# EAGLE design pocketbone (EAGLE 7.6.0)

## Sheet 1 of 3
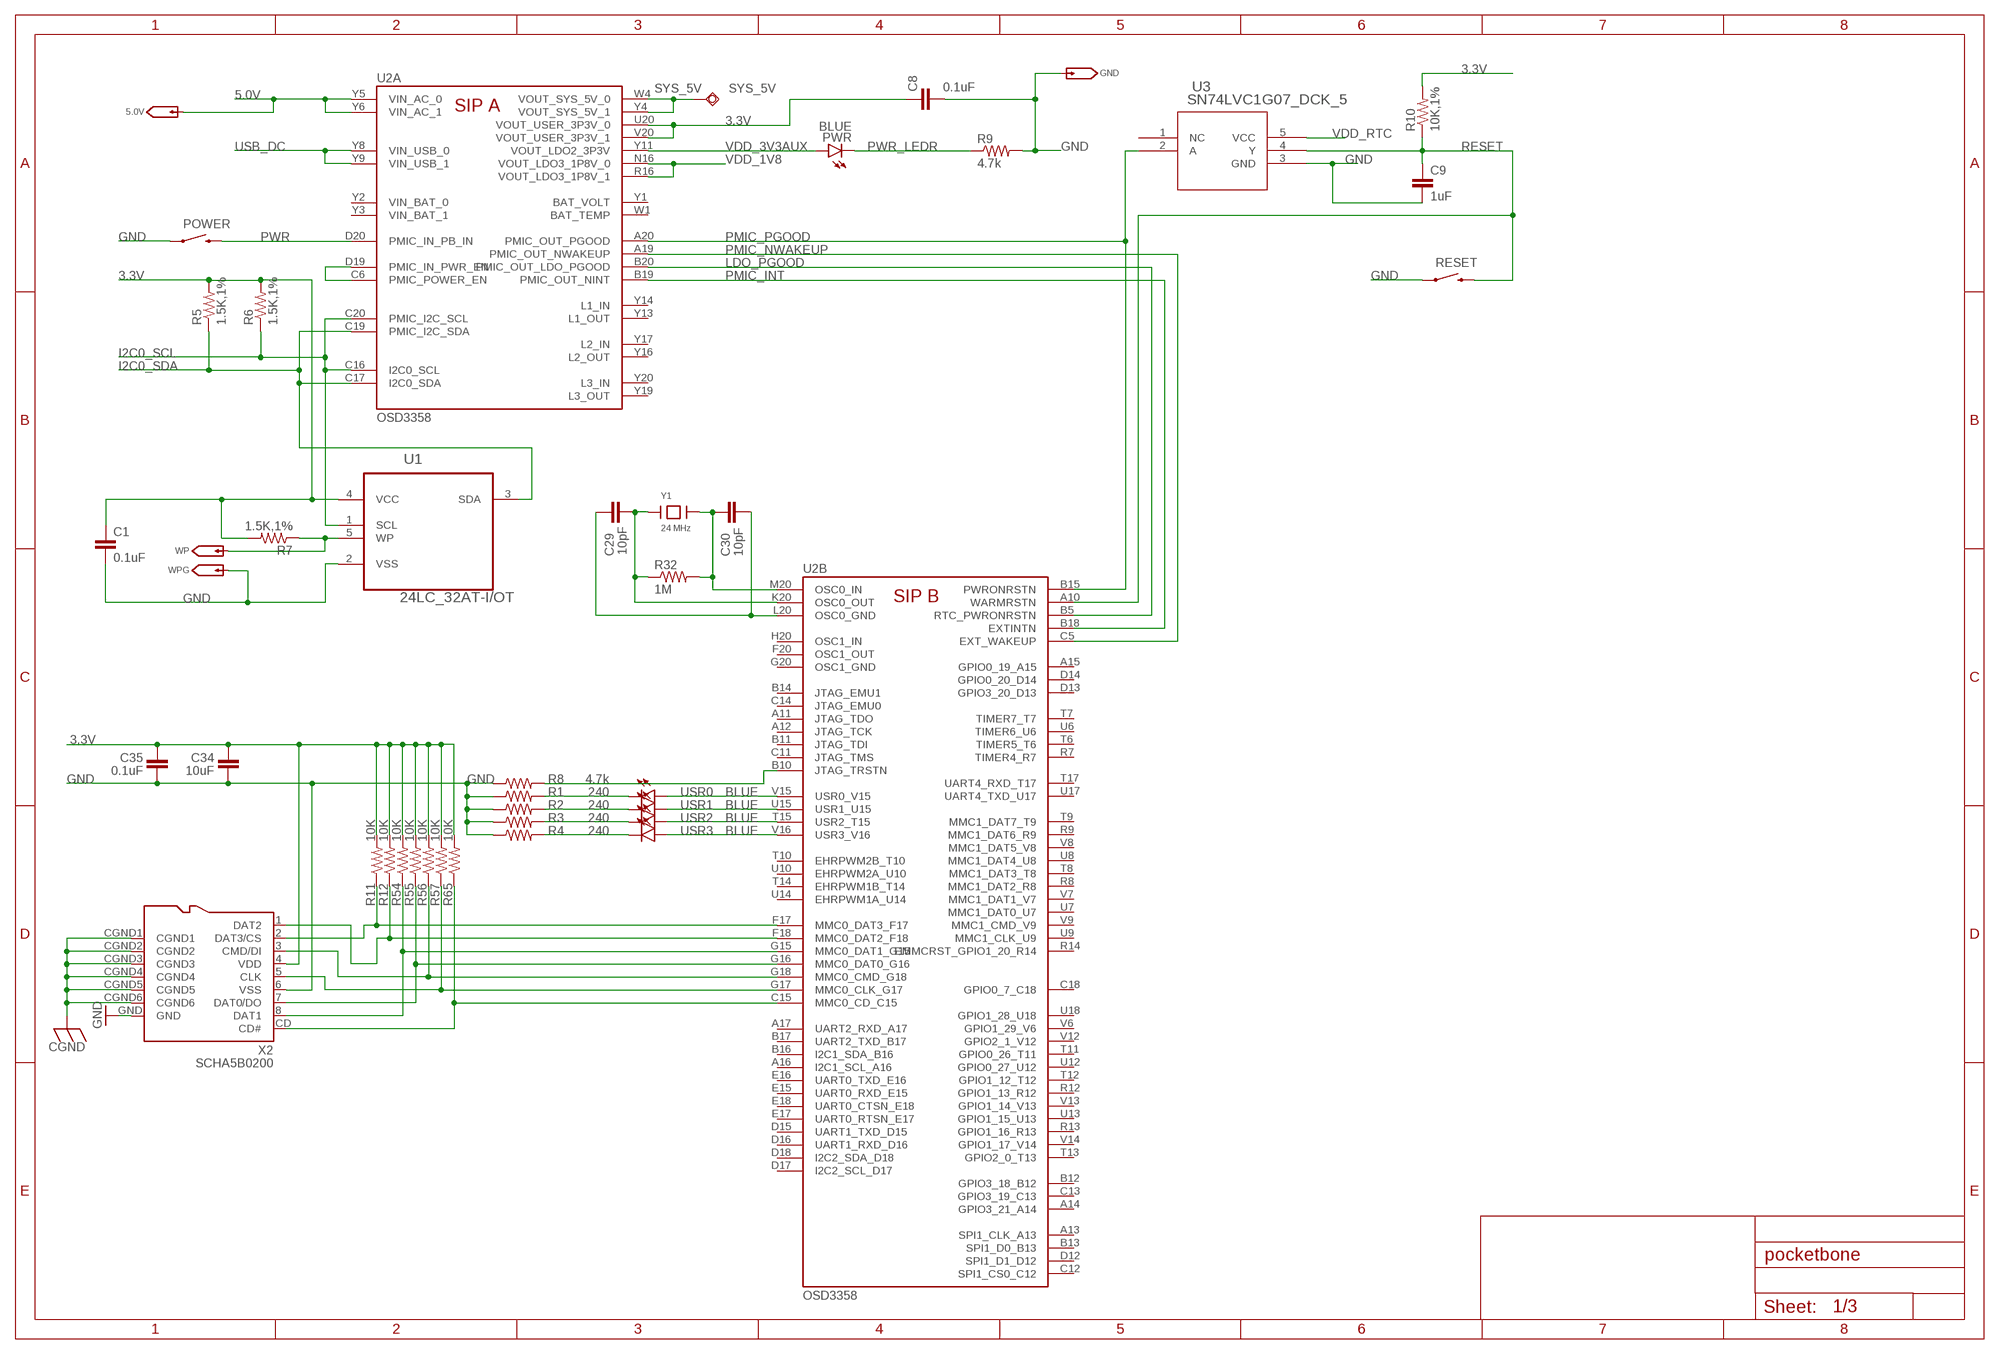
[diagram p0: schematic, sheet 1]

### Parts
5.0V  GHI_TESTPAD/W_HOLE_1X1  [GHI2_TESTPAD/W_HOLE_1X1]
C1  0.1uF  CAP0402-CAP  [0402-CAP]
C8  0.1uF  CAP0402-CAP  [0402-CAP]
C9  1uF  CAP0402-CAP  [0402-CAP]
C29  10pF  CAP0402-CAP  [0402-CAP]
C30  10pF  CAP0402-CAP  [0402-CAP]
C34  10uF  CAP0805  [0805]
C35  0.1uF  CAP0402-CAP  [0402-CAP]
GND  GHI_TESTPAD/W_HOLE_1X1  [GHI2_TESTPAD/W_HOLE_1X1]
POWER  SWITCH-MOMENTARY-2SMD-1101NE  [TACTILE-SWITCH-1101NE]
PWR  BLUE  LED0603  [LED-0603]
R1  240  RESISTOR0402-RES  [0402-RES]
R2  240  RESISTOR0402-RES  [0402-RES]
R3  240  RESISTOR0402-RES  [0402-RES]
R4  240  RESISTOR0402-RES  [0402-RES]
R5  1.5K,1%  RESISTOR0402-RES  [0402-RES]
R6  1.5K,1%  RESISTOR0402-RES  [0402-RES]
R7  1.5K,1%  RESISTOR0402-RES  [0402-RES]
R8  4.7k  RESISTOR0402-RES  [0402-RES]
R9  4.7k  RESISTOR0402-RES  [0402-RES]
R10  10K,1%  RESISTOR0402-RES  [0402-RES]
R11  10K  RESISTOR0402-RES  [0402-RES]
R12  10K  RESISTOR0402-RES  [0402-RES]
R32  1M  RESISTOR0402-RES  [0402-RES]
R54  10K  RESISTOR0402-RES  [0402-RES]
R55  10K  RESISTOR0402-RES  [0402-RES]
R56  10K  RESISTOR0402-RES  [0402-RES]
R57  10K  RESISTOR0402-RES  [0402-RES]
R65  10K  RESISTOR0402-RES  [0402-RES]
RESET  SWITCH-MOMENTARY-2SMD-1101NE  [TACTILE-SWITCH-1101NE]
SYS_5V  TPSQB1,27  [B1,27]
U1  24LC_32AT-I/OT  [SOT95P290X145-5N]
U2  OSD3358  [OSD3358]
U3  SN74LVC1G07_DCK_5  [DCK5]
USR0  BLUE  LED0603  [LED-0603]
USR1  BLUE  LED0603  [LED-0603]
USR2  BLUE  LED0603  [LED-0603]
USR3  BLUE  LED0603  [LED-0603]
WP  GHI_TESTPAD/W_HOLE_1X1  [GHI2_TESTPAD/W_HOLE_1X1]
WPG  GHI_TESTPAD/W_HOLE_1X1  [GHI2_TESTPAD/W_HOLE_1X1]
X2  SCHA5B0200  SCHA5B0200(ALPS_USD)  [SCHA5B0200]
Y1  24 MHz  CRYSTAL_5X3.2MM  [CRYSTAL_5X3.2MM]

### Nets
3.3V [power]: C1.1 C8.1 C34.2 C35.2 R5.2 R6.2 R7.2 R10.2 R11.2 R12.2 R54.2 R55.2 R56.2 R57.2 R65.2 U1.4(VCC) U2.U20(A:VOUT_USER_3P3V_0) U2.V20(A:VOUT_USER_3P3V_1) X2.4(VDD) ; also sheet 2
5.0V [power]: 5.0V.P$1(TP) U2.Y5(A:VIN_AC_0) U2.Y6(A:VIN_AC_1) ; also sheet 2
CGND: X2.CGND1 X2.CGND2 X2.CGND3 X2.CGND4 X2.CGND5 X2.CGND6 ; also sheet 2
GND [ground]: C1.2 C8.2 C9.2 C34.1 C35.1 GND.P$1(TP) POWER.1 R1.1 R2.1 R3.1 R4.1 R8.1 R9.2 RESET.1 U1.2(VSS) U3.3(GND) WPG.P$1(TP) X2.6(VSS) X2.GND ; also sheet 2,3
I2C0_SCL: R6.1 U1.1(SCL) U2.C16(A:I2C0_SCL) U2.C20(A:PMIC_I2C_SCL)
I2C0_SDA: R5.1 U1.3(SDA) U2.C17(A:I2C0_SDA) U2.C19(A:PMIC_I2C_SDA)
LDO_PGOOD: U2.B5(B:RTC_PWRONRSTN) U2.B20(A:PMIC_OUT_LDO_PGOOD)
N$3: R56.1 U2.G18(B:MMC0_CMD_G18) X2.3(CMD/DI)
N$4: R55.1 U2.G16(B:MMC0_DAT0_G16) X2.7(DAT0/DO)
N$6: R54.1 U2.G15(B:MMC0_DAT1_G15) X2.8(DAT1)
N$7: R65.1 U2.C15(B:MMC0_CD_C15) X2.CD(CD#)
N$8: R57.1 U2.G17(B:MMC0_CLK_G17) X2.5(CLK)
N$9: R11.1 U2.F17(B:MMC0_DAT3_F17) X2.2(DAT3/CS)
N$12: U2.C6(A:PMIC_POWER_EN) U2.D19(A:PMIC_IN_PWR_EN)
N$26: C30.1 R32.2 U2.M20(B:OSC0_IN) Y1.2
N$27: C29.1 R32.1 U2.K20(B:OSC0_OUT) Y1.1
N$28: R7.1 U1.5(WP) WP.P$1(TP)
N$31: C29.2 C30.2 U2.L20(B:OSC0_GND)
N$42: R8.2 U2.B10(B:JTAG_TRSTN)
N$43: U2.V16(B:USR3_V16) USR3.A
N$44: U2.T15(B:USR2_T15) USR2.A
N$45: U2.U15(B:USR1_U15) USR1.A
N$46: U2.V15(B:USR0_V15) USR0.A
N$47: R1.2 USR0.C
N$57: R2.2 USR1.C
N$58: R3.2 USR2.C
N$59: R4.2 USR3.C
NTE1: R12.1 U2.F18(B:MMC0_DAT2_F18) X2.1(DAT2)
PMIC_INT: U2.B18(B:EXTINTN) U2.B19(A:PMIC_OUT_NINT)
PMIC_NWAKEUP: U2.A19(A:PMIC_OUT_NWAKEUP) U2.C5(B:EXT_WAKEUP)
PMIC_PGOOD: U2.A20(A:PMIC_OUT_PGOOD) U2.B15(B:PWRONRSTN) U3.2(A)
PWR: POWER.2 U2.D20(A:PMIC_IN_PB_IN)
PWR_LEDR: PWR.C R9.1
RESET: C9.1 R10.1 RESET.2 U2.A10(B:WARMRSTN) U3.4(Y)
SYS_5V [power]: SYS_5V.TP U2.W4(A:VOUT_SYS_5V_0) U2.Y4(A:VOUT_SYS_5V_1) ; also sheet 2
USB_DC [power]: U2.Y8(A:VIN_USB_0) U2.Y9(A:VIN_USB_1) ; also sheet 2
VDD_1V8: U2.N16(A:VOUT_LDO3_1P8V_0) U2.R16(A:VOUT_LDO3_1P8V_1) ; also sheet 3
VDD_3V3AUX: PWR.A U2.Y11(A:VOUT_LDO2_3P3V)
VDD_RTC: U3.5(VCC) ; also sheet 3
Unconnected: U2.A11(B:JTAG_TDO) U2.A12(B:JTAG_TCK) U2.A13(B:SPI1_CLK_A13) U2.A14(B:GPIO3_21_A14) U2.A15(B:GPIO0_19_A15) U2.A16(B:I2C1_SCL_A16) U2.A17(B:UART2_RXD_A17) U2.B1(D:NC4) U2.B2(D:NC5) U2.B3(D:NC6) U2.B11(B:JTAG_TDI) U2.B12(B:GPIO3_18_B12) U2.B13(B:SPI1_D0_B13) U2.B14(B:JTAG_EMU1) U2.B16(B:I2C1_SDA_B16) U2.B17(B:UART2_TXD_B17) U2.C1(D:NC12) U2.C2(D:NC20) U2.C3(D:NC21) U2.C4(D:NC22) U2.C11(B:JTAG_TMS) U2.C12(B:SPI1_CS0_C12) U2.C13(B:GPIO3_19_C13) U2.C14(B:JTAG_EMU0) U2.C18(B:GPIO0_7_C18) U2.D1(D:NC24) U2.D2(D:NC31) U2.D3(D:NC32) U2.D4(D:NC33) U2.D5(D:NC34) U2.D12(B:SPI1_D1_D12) U2.D13(B:GPIO3_20_D13) U2.D14(B:GPIO0_20_D14) U2.D15(B:UART1_TXD_D15) U2.D16(B:UART1_RXD_D16) U2.D17(B:I2C2_SCL_D17) U2.D18(B:I2C2_SDA_D18) U2.E1(D:NC46) U2.E2(D:NC47) U2.E3(D:NC48) U2.E4(D:NC58) U2.E15(B:UART0_RXD_E15) U2.E16(B:UART0_TXD_E16) U2.E17(B:UART0_RTSN_E17) U2.E18(B:UART0_CTSN_E18) U2.F1(D:NC59) U2.F2(D:NC60) U2.F3(D:NC61) U2.F4(D:NC68) U2.F20(B:OSC1_OUT) U2.G1(D:NC69) U2.G2(D:NC70) U2.G3(D:NC71) U2.G4(D:NC76) U2.G20(B:OSC1_GND) U2.H1(D:NC77) U2.H2(D:NC78) U2.H3(D:NC79) U2.H4(D:NC84) U2.H20(B:OSC1_IN) U2.J1(D:NC85) U2.J2(D:NC86) U2.J3(D:NC87) U2.J4(D:NC94) U2.K1(D:NC95) U2.K2(D:NC96) U2.K3(D:NC97) U2.K4(D:NC104) U2.L1(D:NC105) U2.L2(D:NC106) U2.L3(D:NC107) U2.L4(D:NC111) U2.M1(D:NC112) U2.M2(D:NC113) U2.M3(D:NC114) U2.M4(D:NC121) U2.N1(D:NC123) U2.N2(D:NC124) U2.N3(D:NC136) U2.N4(D:NC137) U2.P1(D:NC138) U2.P2(D:NC23) U2.P3(D:NC45) U2.P4(D:NC122) U2.R7(B:TIMER4_R7) U2.R8(B:MMC1_DAT2_R8) U2.R9(B:MMC1_DAT6_R9) U2.R12(B:GPIO1_13_R12) U2.R13(B:GPIO1_16_R13) U2.R14(B:EMMCRST_GPIO1_20_R14) U2.T6(B:TIMER5_T6) U2.T7(B:TIMER7_T7) U2.T8(B:MMC1_DAT3_T8) U2.T9(B:MMC1_DAT7_T9) U2.T10(B:EHRPWM2B_T10) U2.T11(B:GPIO0_26_T11) U2.T12(B:GPIO1_12_T12) U2.T13(B:GPIO2_0_T13) U2.T14(B:EHRPWM1B_T14) U2.T17(B:UART4_RXD_T17) U2.U6(B:TIMER6_U6) U2.U7(B:MMC1_DAT0_U7) U2.U8(B:MMC1_DAT4_U8) U2.U9(B:MMC1_CLK_U9) U2.U10(B:EHRPWM2A_U10) U2.U11(D:NC2) U2.U12(B:GPIO0_27_U12) U2.U13(B:GPIO1_15_U13) U2.U14(B:EHRPWM1A_U14) U2.U17(B:UART4_TXD_U17) U2.U18(B:GPIO1_28_U18) U2.V6(B:GPIO1_29_V6) U2.V7(B:MMC1_DAT1_V7) U2.V8(B:MMC1_DAT5_V8) U2.V9(B:MMC1_CMD_V9) U2.V10(D:NC3) U2.V11(D:NC1) U2.V12(B:GPIO2_1_V12) U2.V13(B:GPIO1_14_V13) U2.V14(B:GPIO1_17_V14) U2.W1(A:BAT_TEMP) U2.Y1(A:BAT_VOLT) U2.Y13(A:L1_OUT) U2.Y14(A:L1_IN) U2.Y16(A:L2_OUT) U2.Y17(A:L2_IN) U2.Y19(A:L3_OUT) U2.Y20(A:L3_IN) U3.1(NC)

## Sheet 2 of 3
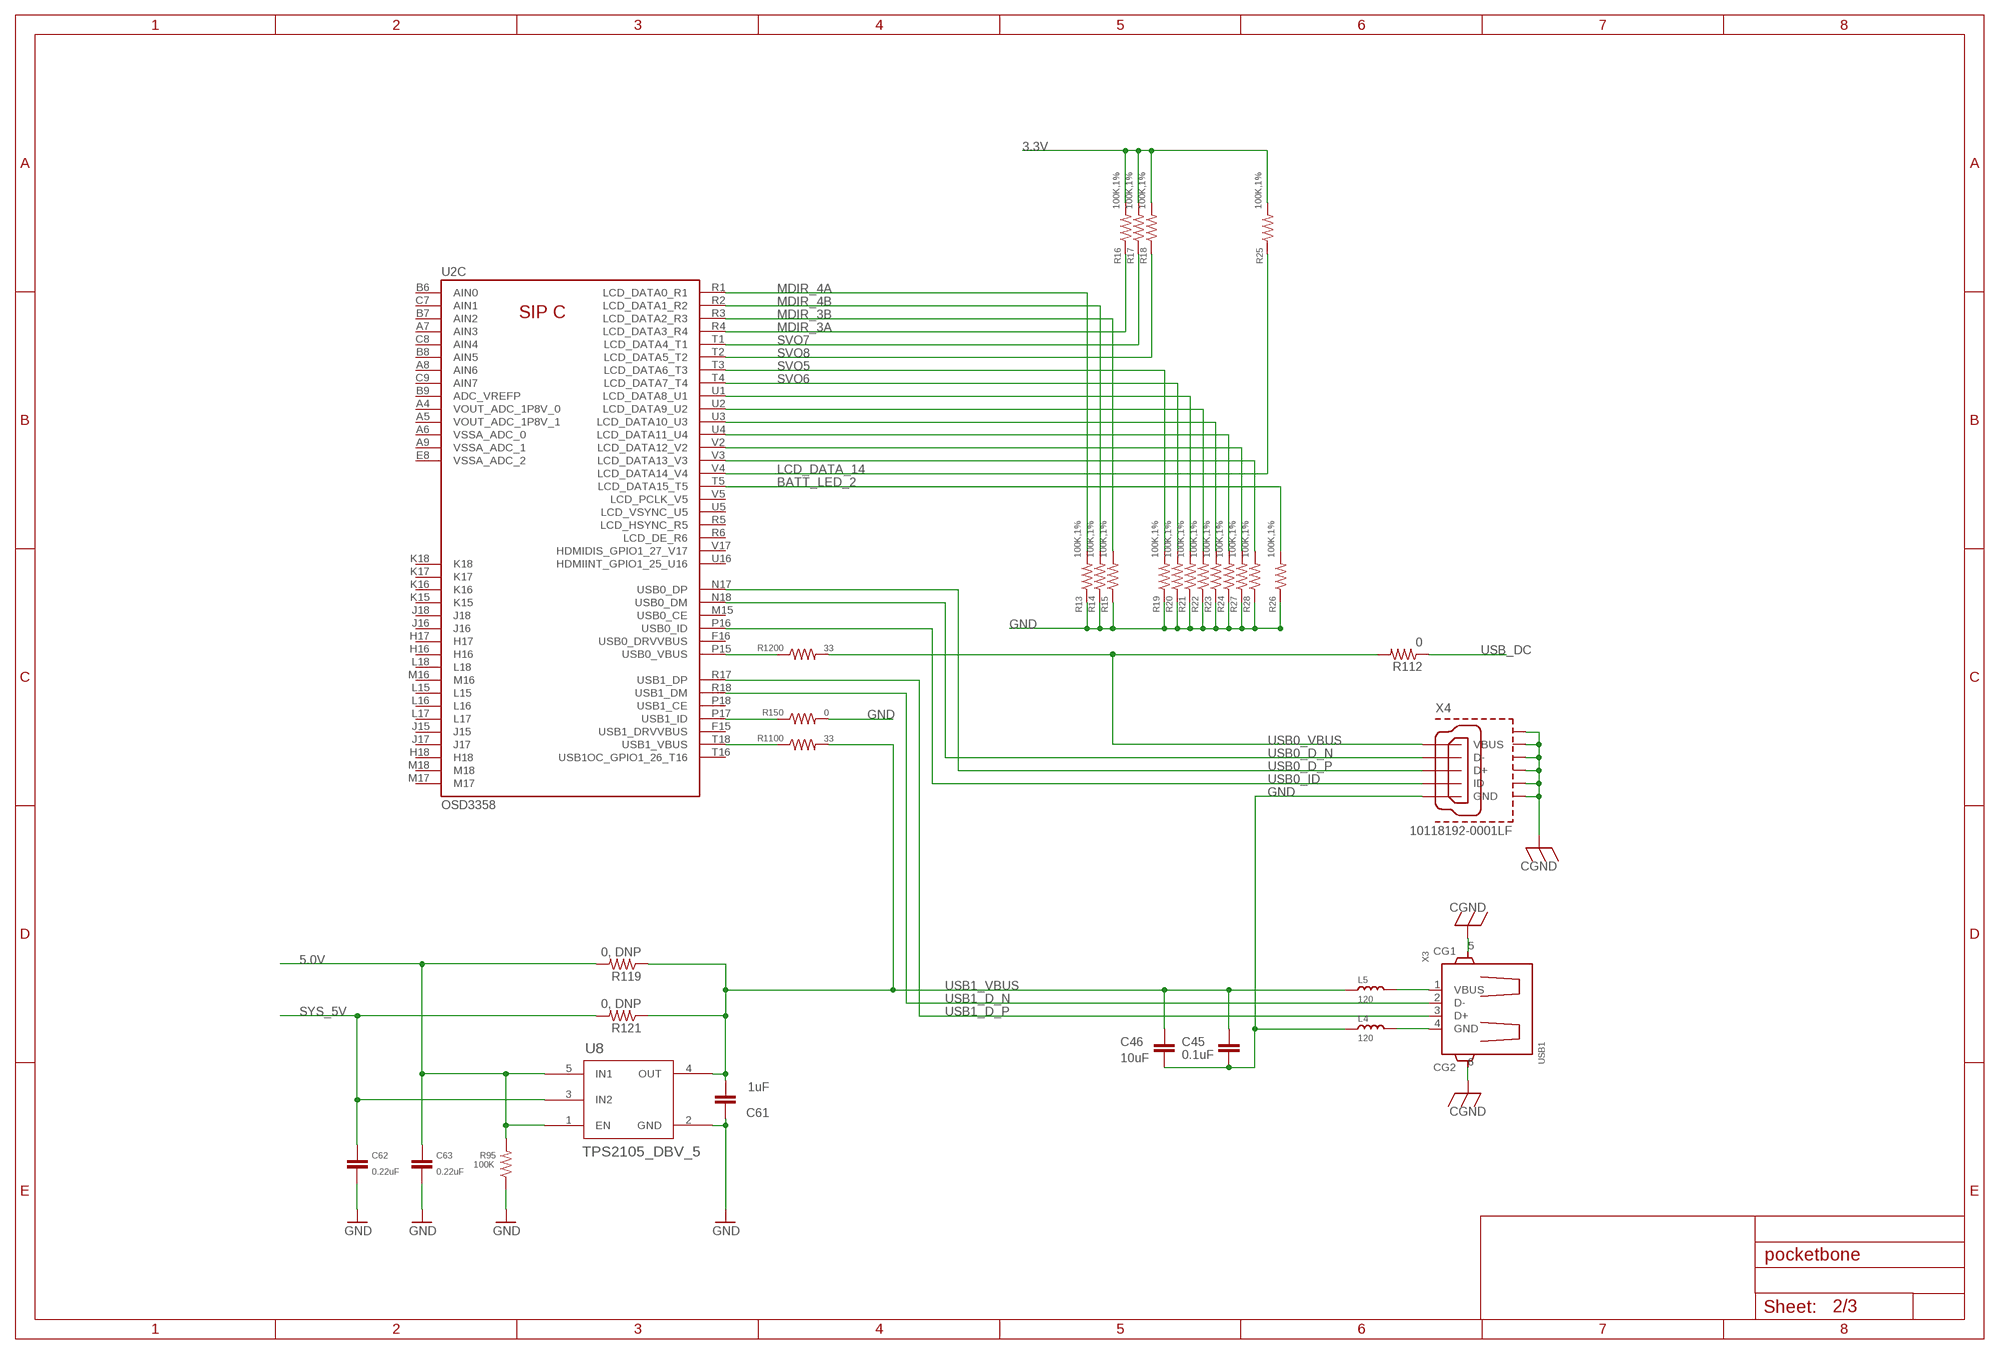
[diagram p1: schematic, sheet 2]

### Parts
C45  0.1uF  CAP0402-CAP  [0402-CAP]
C46  10uF  CAP0805  [0805]
C61  1uF  CAP0402-CAP  [0402-CAP]
C62  0.22uF  CAP0402-CAP  [0402-CAP]
C63  0.22uF  CAP0402-CAP  [0402-CAP]
L4  120  INDUCTOR/FERRITE-BEAD'0603'  [L0603]
L5  120  INDUCTOR/FERRITE-BEAD'0603'  [L0603]
R13  100K,1%  RESISTOR0402-RES  [0402-RES]
R14  100K,1%  RESISTOR0402-RES  [0402-RES]
R15  100K,1%  RESISTOR0402-RES  [0402-RES]
R16  100K,1%  RESISTOR0402-RES  [0402-RES]
R17  100K,1%  RESISTOR0402-RES  [0402-RES]
R18  100K,1%  RESISTOR0402-RES  [0402-RES]
R19  100K,1%  RESISTOR0402-RES  [0402-RES]
R20  100K,1%  RESISTOR0402-RES  [0402-RES]
R21  100K,1%  RESISTOR0402-RES  [0402-RES]
R22  100K,1%  RESISTOR0402-RES  [0402-RES]
R23  100K,1%  RESISTOR0402-RES  [0402-RES]
R24  100K,1%  RESISTOR0402-RES  [0402-RES]
R25  100K,1%  RESISTOR0402-RES  [0402-RES]
R26  100K,1%  RESISTOR0402-RES  [0402-RES]
R27  100K,1%  RESISTOR0402-RES  [0402-RES]
R28  100K,1%  RESISTOR0402-RES  [0402-RES]
R95  100K  RESISTOR0402-RES  [0402-RES]
R112  0  RESISTOR0603  [0603-RES]
R119  0, DNP  RESISTOR0603  [0603-RES]
R121  0, DNP  RESISTOR0603  [0603-RES]
R150  0  RESISTOR0402-RES  [0402-RES]
R1100  33  RESISTOR0402-RES  [0402-RES]
R1200  33  RESISTOR0402-RES  [0402-RES]
U8  TPS2105_DBV_5  [DBV5]
X3  USB1  USB_HOST_W/CHASSIS_GND  [USB_HOST_HORIZONTAL_W/CHASSIS_GND]
X4  10118192-0001LF  [10118192-0001LF(MICRO-USB-B-AMPHENOL-FCI)]

### Nets
3.3V [power]: R16.2 R17.2 R18.2 R25.2 ; also sheet 1
5.0V [power]: C63.1 R95.2 R119.2 U8.1(EN) U8.5(IN1) ; also sheet 1
BATT_LED_2: R26.2 U2.T5(C:LCD_DATA15_T5)
CGND: X3.5(CG1) X3.6(CG2) X4.CGND1(SGND1) X4.CGND2(SGND2) X4.CGND3(SGND3) X4.CGND4(SGND4) X4.CGND5(SGND5) X4.CGND6(SGND6) ; also sheet 1
EQEP_1A: R27.2 U2.V2(C:LCD_DATA12_V2)
EQEP_1B: R28.2 U2.V3(C:LCD_DATA13_V3)
GND [ground]: C45.2 C46.2 C61.1 C62.2 C63.2 L4.1 R13.1 R14.1 R15.1 R19.1 R20.1 R21.1 R22.1 R23.1 R24.1 R26.1 R27.1 R28.1 R95.1 R150.2 U8.2(GND) X4.GND ; also sheet 1,3
LCD_DATA_14: R25.1 U2.V4(C:LCD_DATA14_V4)
MDIR_2B: R24.2 U2.U4(C:LCD_DATA11_U4)
MDIR_3A: R16.1 U2.R4(C:LCD_DATA3_R4)
MDIR_3B: R15.2 U2.R3(C:LCD_DATA2_R3)
MDIR_4A: R13.2 U2.R1(C:LCD_DATA0_R1)
MDIR_4B: R14.2 U2.R2(C:LCD_DATA1_R2)
N$1: R1200.1 U2.P15(C:USB0_VBUS)
N$11: R1100.1 U2.T18(C:USB1_VBUS)
N$126: R150.1 U2.P17(C:USB1_ID)
N$128 [power]: L4.2 X3.4(GND)
N$130 [power]: L5.2 X3.1(VBUS)
SERVO_EN: R23.2 U2.U3(C:LCD_DATA10_U3)
SVO5: R19.2 U2.T3(C:LCD_DATA6_T3)
SVO6: R20.2 U2.T4(C:LCD_DATA7_T4)
SVO7: R17.1 U2.T1(C:LCD_DATA4_T1)
SVO8: R18.1 U2.T2(C:LCD_DATA5_T2)
SYS_5V [power]: C62.1 R121.2 U8.3(IN2) ; also sheet 1
UART5_RX: R22.2 U2.U2(C:LCD_DATA9_U2)
UART5_TX: R21.2 U2.U1(C:LCD_DATA8_U1)
USB0_D_N: U2.N18(C:USB0_DM) X4.D-
USB0_D_P: U2.N17(C:USB0_DP) X4.D+
USB0_ID: U2.P16(C:USB0_ID) X4.ID
USB0_VBUS: R112.2 R1200.2 X4.VBUS
USB1_D_N: U2.R18(C:USB1_DM) X3.2(D-)
USB1_D_P: U2.R17(C:USB1_DP) X3.3(D+)
USB1_VBUS: C45.1 C46.1 C61.2 L5.1 R119.1 R121.1 R1100.2 U8.4(OUT)
USB_DC [power]: R112.1 ; also sheet 1
Unconnected: U2.A4(C:VOUT_ADC_1P8V_0) U2.A5(C:VOUT_ADC_1P8V_1) U2.A6(C:VSSA_ADC_0) U2.A7(C:AIN3) U2.A8(C:AIN6) U2.A9(C:VSSA_ADC_1) U2.B6(C:AIN0) U2.B7(C:AIN2) U2.B8(C:AIN5) U2.B9(C:ADC_VREFP) U2.C7(C:AIN1) U2.C8(C:AIN4) U2.C9(C:AIN7) U2.E8(C:VSSA_ADC_2) U2.F15(C:USB1_DRVVBUS) U2.F16(C:USB0_DRVVBUS) U2.H16(C:H16) U2.H17(C:H17) U2.H18(C:H18) U2.J15(C:J15) U2.J16(C:J16) U2.J17(C:J17) U2.J18(C:J18) U2.K15(C:K15) U2.K16(C:K16) U2.K17(C:K17) U2.K18(C:K18) U2.L15(C:L15) U2.L16(C:L16) U2.L17(C:L17) U2.L18(C:L18) U2.M15(C:USB0_CE) U2.M16(C:M16) U2.M17(C:M17) U2.M18(C:M18) U2.P18(C:USB1_CE) U2.R5(C:LCD_HSYNC_R5) U2.R6(C:LCD_DE_R6) U2.T16(C:USB1OC_GPIO1_26_T16) U2.U5(C:LCD_VSYNC_U5) U2.U16(C:HDMIINT_GPIO1_25_U16) U2.V5(C:LCD_PCLK_V5) U2.V17(C:HDMIDIS_GPIO1_27_V17)

## Sheet 3 of 3
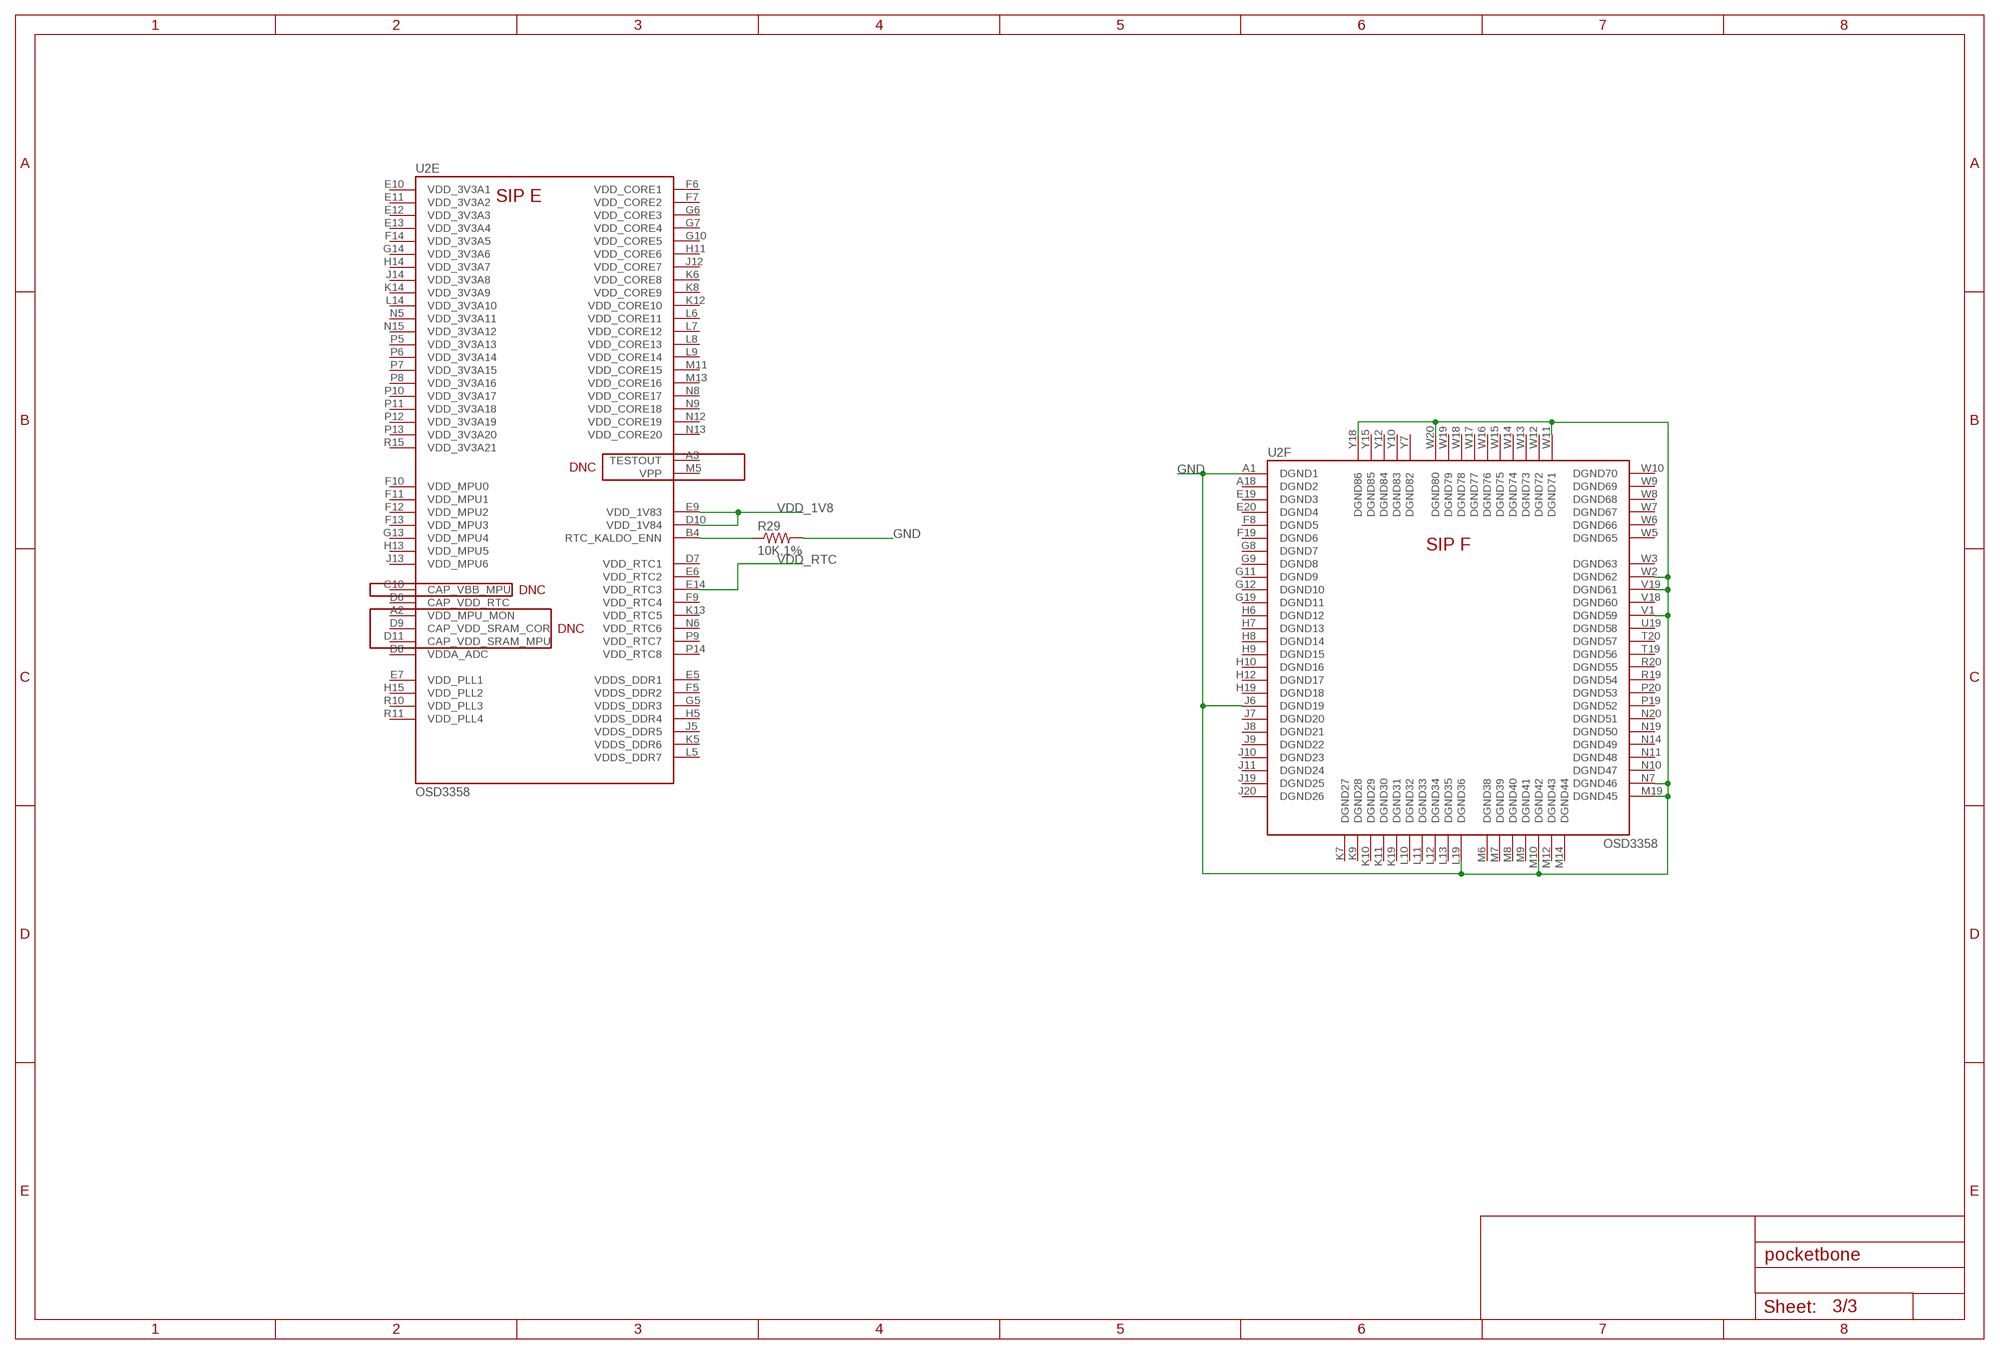
[diagram p2: schematic, sheet 3]

### Parts
R29  10K,1%  RESISTOR0402-RES  [0402-RES]

### Nets
GND [ground]: R29.2 U2.A1(F:DGND1) U2.J6(F:DGND19) U2.L19(F:DGND36) U2.M10(F:DGND42) U2.M19(F:DGND45) U2.N7(F:DGND46) U2.V1(F:DGND59) U2.V19(F:DGND61) U2.W2(F:DGND62) U2.W11(F:DGND71) U2.W20(F:DGND80) U2.Y18(F:DGND86) ; also sheet 1,2
N$131: R29.1 U2.B4(E:RTC_KALDO_ENN)
VDD_1V8: U2.D10(E:VDD_1V84) U2.E9(E:VDD_1V83) ; also sheet 1
VDD_RTC: U2.E14(E:VDD_RTC3) ; also sheet 1
Unconnected: U2.A2(E:VDD_MPU_MON) U2.A3(E:TESTOUT) U2.A18(F:DGND2) U2.C10(E:CAP_VBB_MPU) U2.D6(E:CAP_VDD_RTC) U2.D7(E:VDD_RTC1) U2.D8(E:VDDA_ADC) U2.D9(E:CAP_VDD_SRAM_COR) U2.D11(E:CAP_VDD_SRAM_MPU) U2.E5(E:VDDS_DDR1) U2.E6(E:VDD_RTC2) U2.E7(E:VDD_PLL1) U2.E10(E:VDD_3V3A1) U2.E11(E:VDD_3V3A2) U2.E12(E:VDD_3V3A3) U2.E13(E:VDD_3V3A4) U2.E19(F:DGND3) U2.E20(F:DGND4) U2.F5(E:VDDS_DDR2) U2.F6(E:VDD_CORE1) U2.F7(E:VDD_CORE2) U2.F8(F:DGND5) U2.F9(E:VDD_RTC4) U2.F10(E:VDD_MPU0) U2.F11(E:VDD_MPU1) U2.F12(E:VDD_MPU2) U2.F13(E:VDD_MPU3) U2.F14(E:VDD_3V3A5) U2.F19(F:DGND6) U2.G5(E:VDDS_DDR3) U2.G6(E:VDD_CORE3) U2.G7(E:VDD_CORE4) U2.G8(F:DGND7) U2.G9(F:DGND8) U2.G10(E:VDD_CORE5) U2.G11(F:DGND9) U2.G12(F:DGND10) U2.G13(E:VDD_MPU4) U2.G14(E:VDD_3V3A6) U2.G19(F:DGND11) U2.H5(E:VDDS_DDR4) U2.H6(F:DGND12) U2.H7(F:DGND13) U2.H8(F:DGND14) U2.H9(F:DGND15) U2.H10(F:DGND16) U2.H11(E:VDD_CORE6) U2.H12(F:DGND17) U2.H13(E:VDD_MPU5) U2.H14(E:VDD_3V3A7) U2.H15(E:VDD_PLL2) U2.H19(F:DGND18) U2.J5(E:VDDS_DDR5) U2.J7(F:DGND20) U2.J8(F:DGND21) U2.J9(F:DGND22) U2.J10(F:DGND23) U2.J11(F:DGND24) U2.J12(E:VDD_CORE7) U2.J13(E:VDD_MPU6) U2.J14(E:VDD_3V3A8) U2.J19(F:DGND25) U2.J20(F:DGND26) U2.K5(E:VDDS_DDR6) U2.K6(E:VDD_CORE8) U2.K7(F:DGND27) U2.K8(E:VDD_CORE9) U2.K9(F:DGND28) U2.K10(F:DGND29) U2.K11(F:DGND30) U2.K12(E:VDD_CORE10) U2.K13(E:VDD_RTC5) U2.K14(E:VDD_3V3A9) U2.K19(F:DGND31) U2.L5(E:VDDS_DDR7) U2.L6(E:VDD_CORE11) U2.L7(E:VDD_CORE12) U2.L8(E:VDD_CORE13) U2.L9(E:VDD_CORE14) U2.L10(F:DGND32) U2.L11(F:DGND33) U2.L12(F:DGND34) U2.L13(F:DGND35) U2.L14(E:VDD_3V3A10) U2.M5(E:VPP) U2.M6(F:DGND38) U2.M7(F:DGND39) U2.M8(F:DGND40) U2.M9(F:DGND41) U2.M11(E:VDD_CORE15) U2.M12(F:DGND43) U2.M13(E:VDD_CORE16) U2.M14(F:DGND44) U2.N5(E:VDD_3V3A11) U2.N6(E:VDD_RTC6) U2.N8(E:VDD_CORE17) U2.N9(E:VDD_CORE18) U2.N10(F:DGND47) U2.N11(F:DGND48) U2.N12(E:VDD_CORE19) U2.N13(E:VDD_CORE20) U2.N14(F:DGND49) U2.N15(E:VDD_3V3A12) U2.N19(F:DGND50) U2.N20(F:DGND51) U2.P5(E:VDD_3V3A13) U2.P6(E:VDD_3V3A14) U2.P7(E:VDD_3V3A15) U2.P8(E:VDD_3V3A16) U2.P9(E:VDD_RTC7) U2.P10(E:VDD_3V3A17) U2.P11(E:VDD_3V3A18) U2.P12(E:VDD_3V3A19) U2.P13(E:VDD_3V3A20) U2.P14(E:VDD_RTC8) U2.P19(F:DGND52) U2.P20(F:DGND53) U2.R10(E:VDD_PLL3) U2.R11(E:VDD_PLL4) U2.R15(E:VDD_3V3A21) U2.R19(F:DGND54) U2.R20(F:DGND55) U2.T19(F:DGND56) U2.T20(F:DGND57) U2.U19(F:DGND58) U2.V18(F:DGND60) U2.W3(F:DGND63) U2.W5(F:DGND65) U2.W6(F:DGND66) U2.W7(F:DGND67) U2.W8(F:DGND68) U2.W9(F:DGND69) U2.W10(F:DGND70) U2.W12(F:DGND72) U2.W13(F:DGND73) U2.W14(F:DGND74) U2.W15(F:DGND75) U2.W16(F:DGND76) U2.W17(F:DGND77) U2.W18(F:DGND78) U2.W19(F:DGND79) U2.Y7(F:DGND82) U2.Y10(F:DGND83) U2.Y12(F:DGND84) U2.Y15(F:DGND85)

## Power pins joined to a net without a drawn wire
VIN_BAT_0: U2.Y2(A:VIN_BAT_0)
VIN_BAT_1: U2.Y3(A:VIN_BAT_1)

## Library data of the parts
5.0V GND WP WPG = pocketbone:GHI_TESTPAD/W_HOLE_1X1
C1 C8 C9 C29 C30 C34 C35 C45 C46 C61-C63 = Strawson_Eagle_Lib:CAP: Capacitor Standard 0603 ceramic capacitor, and 0.1" leaded capacitor.
L4 L5 = Seeed-OPL-Inductor:INDUCTOR/FERRITE-BEAD
POWER RESET = SparkFun-Electromechanical:SWITCH-MOMENTARY-2: Various NO switches- pushbuttons, reed, etc; PROD_ID: SWCH-00815
PWR USR0 USR1-USR3 = BeagleBone_Blue:LED: LEDs Standard schematic elements and footprints for 5mm, 3mm, 1206, and 0603 sized LEDs. 5mm - Spark Fun Electronics SKU : COM-00529 (and others)
R1-R29 R32 R54-R57 R65 R95 R150 R1100 R1200 = Strawson_Eagle_Lib:RESISTOR: Resistor Basic schematic elements and footprints for 0603, 1206, and PTH resistors.
R112 R119 R121 = SparkFun-Resistors:RESISTOR: Resistor Basic schematic elements and footprints for 0603, 1206, and PTH resistors.
SYS_5V = testpad:TPSQ: Test pad
U1 = pocketbone:24LC_: IC, I2C Serial EEPROM,SOT-23-5; MPN: 24LC32AT-I/OT; OC_FARNELL: 1700993; OC_NEWARK: 08P0113; PACKAGE: SOT-23-5; SUPPLIER: MICROCHIP
U2 = pocketbone:OSD3358: Octavo Systems LLC - OSD3358 Rev A
U3 = pocketbone:SN74LVC1G07_DCK_5; DATASHEETURL: http://www.ti.com/lit/gpn/SN74LVC1G07; DESCRIPTION: Single Buffer/Driver With Open-Drain Output; FAMILY_NAME: LL BUFFER AND DRIVER WITH OPEN-DRAIN OUTPUT; GENERIC_PART_NUMBER: SN74LVC1G07; INDUSTRY_STD_PKG_TYPE: SC70; MANUFACTURER: Texas Instruments; MANUFACTURER_PART_NUMBER: sn74lvc1g07_dck_5; PACKAGE_DESIGNATOR: DCK; PIN_COUNT: 5; VENDOR: Texas Instruments
U8 = BeagleBone_Blue:TPS2105_DBV_5; DATASHEETURL: http://www.ti.com/lit/gpn/TPS2105; DESCRIPTION: 2.7-5.5V Dual In/Single Out MOSFET, 0.5A Main/0.1A Aux Input, Act-High Enable, Industrial Temp.; FAMILY_NAME: POWER MULTIPLEXER (MUX); GENERIC_PART_NUMBER: TPS2105; INDUSTRY_STD_PKG_TYPE: SOT-23; MANUFACTURER: Texas Instruments; MANUFACTURER_PART_NUMBER: tps2105_dbv_5; PACKAGE_DESIGNATOR: DBV; PIN_COUNT: 5; VENDOR: Texas Instruments
X2 = GHI-Connectors:SCHA5B0200(ALPS_USD)
X3 = GHI2:USB_HOST_W/CHASSIS_GND
X4 = GHI-Connectors:10118192-0001LF: Amphenol FCI Micro USB Type B Complete Surface Mount (SMT) no guide holes
Y1 = GHI2:CRYSTAL_5X3.2MM

## Net classes
0 default: width 0.152 mm, drill 0.33 mm, clearance 0.152 mm
1 ground: width 0.33 mm, drill 0.33 mm, clearance 0.152 mm
2 usb: width 0.152 mm, clearance 0.152 mm
3 power: width 0.33 mm, drill 0.33 mm, clearance 0.152 mm

## Board
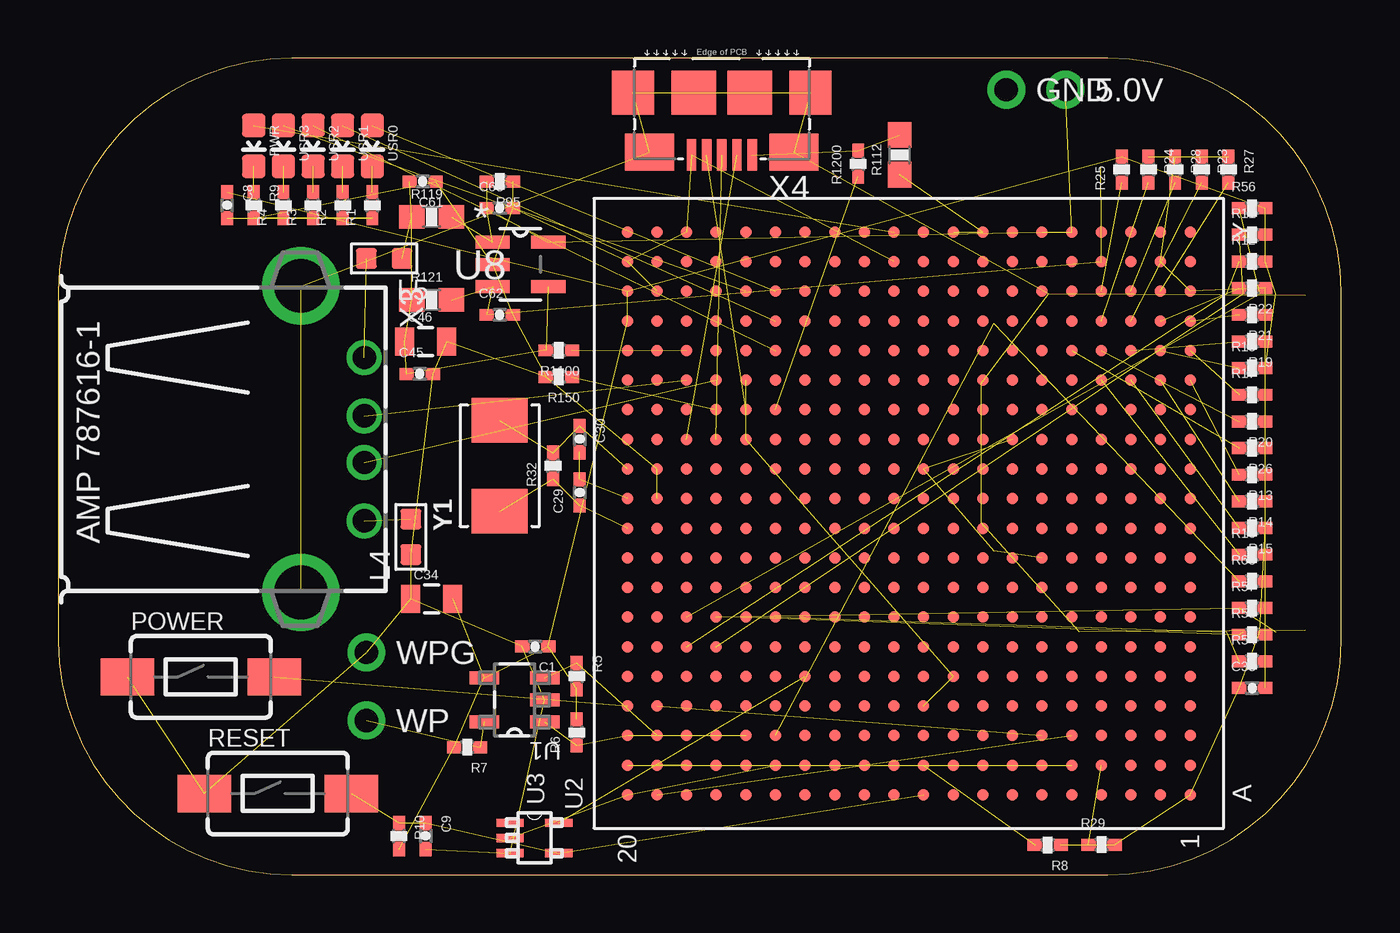
[diagram p3: board, top side]
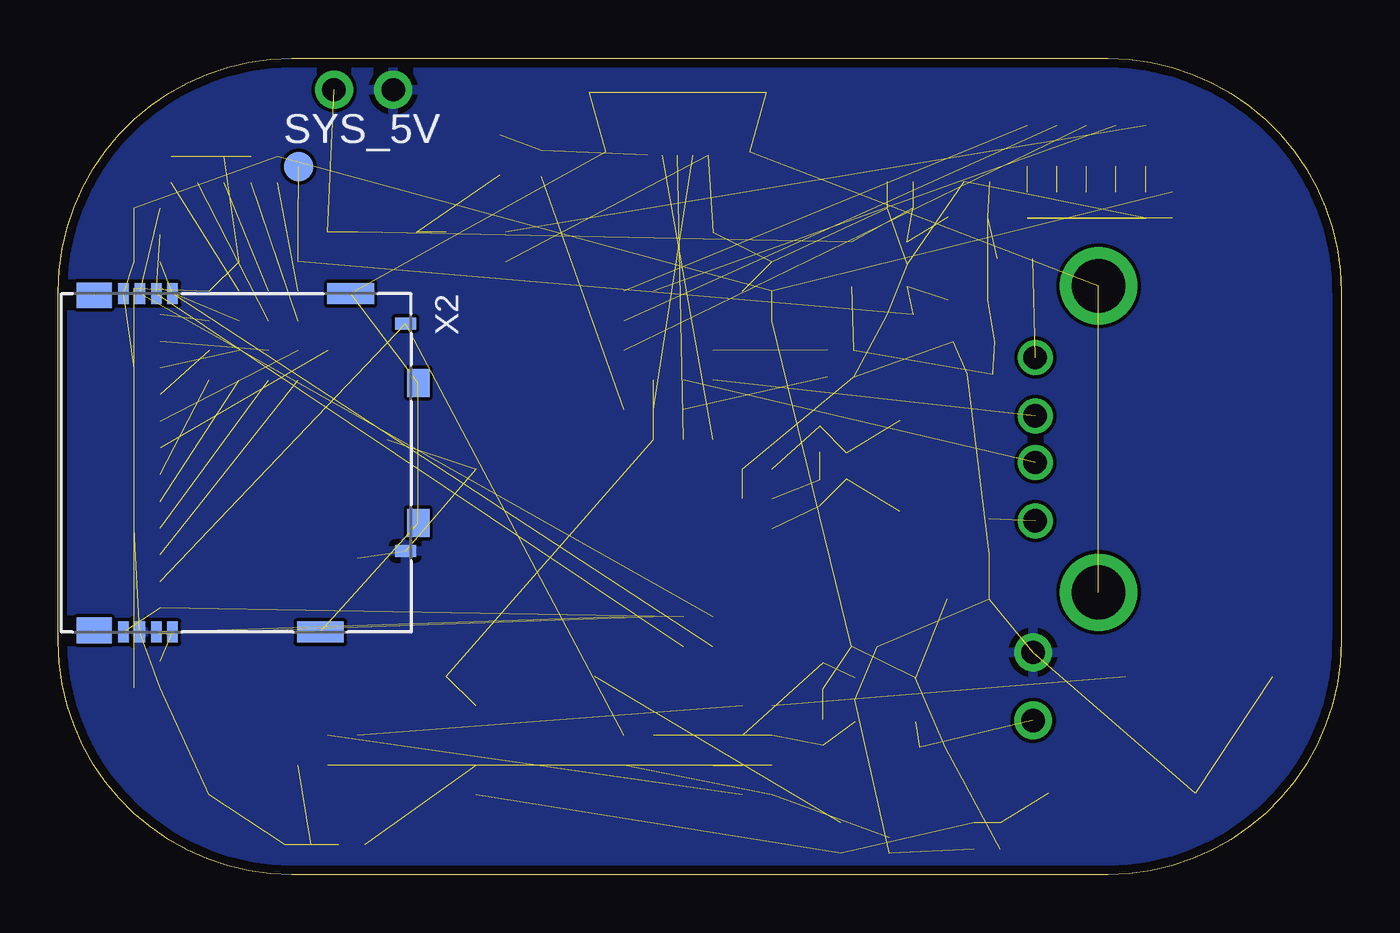
[diagram p4: board, bottom side, seen from below]

Size 55 x 35 mm. Coordinates in mm from the lower left corner, seen from the top.
Outline: 45,35 10,35 arc90 0,25 0,10 arc90 10,0 45,0 arc90 55,10 55,25 arc90 45,35
Copper layers (1*16): Top 0.0356mm / dielectric 1.5011mm / Bottom 0.0356mm
Design rules "default": minimum track width 6mil, minimum drill 13mil, track to track 6mil, track to pad 6mil, pad to pad 6mil, via to via 6mil, smd to smd 6mil, copper to edge 15mil, drill to drill 6mil, minimum pad ring 7mil, minimum via ring 7mil, stop-mask expansion 3mil, vias tented up to drill 15mil, thermal gap 10mil

### Footprints (pad centres in the part's own frame; a part is rotated, then mirrored left to right if it is on the bottom)
GHI2_TESTPAD/W_HOLE_1X1 = drill 1 pad 1.626: P$1 0,0
0402-CAP = smd 0.61 x 0.508: 1 -0.559,0; 2 0.559,0
0805 = smd 0.8 x 1.2: 1 -0.9,0; 2 0.9,0
L0603 = smd 0.889 x 0.889: 1 -0.762,0; 2 0.762,0
TACTILE-SWITCH-1101NE = smd 2.3 x 1.6: 1 -3.15,0; 2 3.15,0
LED-0603 = smd 1 x 1: A 0,-0.877; C 0,0.877
0402-RES = smd 0.61 x 0.508: 1 -0.559,0; 2 0.559,0
0603-RES = smd 1.1 x 1: 1 -0.85,0; 2 0.85,0
B1,27 = smd 1.27 x 1.27: TP 0,0
SOT95P290X145-5N = smd 1.27 x 0.559: 1 -1.295,0.94; 2 -1.295,0; 3 -1.295,-0.94; 4 1.295,-0.94; 5 1.295,0.94
OSD3358 = smd 0.5 x 0.5: A1 -12.065,-12.065; A2 -12.065,-10.795; A3 -12.065,-9.525; A4 -12.065,-8.255; A5 -12.065,-6.985; A6 -12.065,-5.715; A7 -12.065,-4.445; A8 -12.065,-3.175; A9 -12.065,-1.905; A10 -12.065,-0.635; A11 -12.065,0.635; A12 -12.065,1.905; A13 -12.065,3.175; A14 -12.065,4.445; A15 -12.065,5.715; A16 -12.065,6.985; A17 -12.065,8.255; A18 -12.065,9.525; A19 -12.065,10.795; A20 -12.065,12.065; B1 -10.795,-12.065; B2 -10.795,-10.795; B3 -10.795,-9.525; B4 -10.795,-8.255; B5 -10.795,-6.985; B6 -10.795,-5.715; B7 -10.795,-4.445; B8 -10.795,-3.175; B9 -10.795,-1.905; B10 -10.795,-0.635; B11 -10.795,0.635; B12 -10.795,1.905; B13 -10.795,3.175; B14 -10.795,4.445; B15 -10.795,5.715; B16 -10.795,6.985; B17 -10.795,8.255; B18 -10.795,9.525; B19 -10.795,10.795; B20 -10.795,12.065; C1 -9.525,-12.065; C2 -9.525,-10.795; C3 -9.525,-9.525; C4 -9.525,-8.255; C5 -9.525,-6.985; C6 -9.525,-5.715; C7 -9.525,-4.445; C8 -9.525,-3.175; C9 -9.525,-1.905; C10 -9.525,-0.635; C11 -9.525,0.635; C12 -9.525,1.905; C13 -9.525,3.175; C14 -9.525,4.445; C15 -9.525,5.715; C16 -9.525,6.985; C17 -9.525,8.255; C18 -9.525,9.525; C19 -9.525,10.795; C20 -9.525,12.065; D1 -8.255,-12.065; D2 -8.255,-10.795; D3 -8.255,-9.525; D4 -8.255,-8.255; D5 -8.255,-6.985; D6 -8.255,-5.715; D7 -8.255,-4.445; D8 -8.255,-3.175; D9 -8.255,-1.905; D10 -8.255,-0.635; D11 -8.255,0.635; D12 -8.255,1.905; D13 -8.255,3.175; D14 -8.255,4.445; D15 -8.255,5.715; D16 -8.255,6.985; D17 -8.255,8.255; D18 -8.255,9.525; D19 -8.255,10.795; D20 -8.255,12.065; E1 -6.985,-12.065; E2 -6.985,-10.795; E3 -6.985,-9.525; E4 -6.985,-8.255; E5 -6.985,-6.985; E6 -6.985,-5.715; E7 -6.985,-4.445; E8 -6.985,-3.175; E9 -6.985,-1.905; E10 -6.985,-0.635; E11 -6.985,0.635; E12 -6.985,1.905; E13 -6.985,3.175; E14 -6.985,4.445; E15 -6.985,5.715; E16 -6.985,6.985; E17 -6.985,8.255; E18 -6.985,9.525; E19 -6.985,10.795; E20 -6.985,12.065; F1 -5.715,-12.065; F2 -5.715,-10.795; F3 -5.715,-9.525; F4 -5.715,-8.255; F5 -5.715,-6.985; F6 -5.715,-5.715; F7 -5.715,-4.445; F8 -5.715,-3.175; F9 -5.715,-1.905; F10 -5.715,-0.635; F11 -5.715,0.635; F12 -5.715,1.905; F13 -5.715,3.175; F14 -5.715,4.445; F15 -5.715,5.715; F16 -5.715,6.985; F17 -5.715,8.255; F18 -5.715,9.525; F19 -5.715,10.795; F20 -5.715,12.065; G1 -4.445,-12.065; G2 -4.445,-10.795; G3 -4.445,-9.525; G4 -4.445,-8.255; G5 -4.445,-6.985; G6 -4.445,-5.715; G7 -4.445,-4.445; G8 -4.445,-3.175; G9 -4.445,-1.905; G10 -4.445,-0.635; G11 -4.445,0.635; G12 -4.445,1.905; G13 -4.445,3.175; G14 -4.445,4.445; G15 -4.445,5.715; G16 -4.445,6.985; G17 -4.445,8.255; G18 -4.445,9.525; G19 -4.445,10.795; G20 -4.445,12.065; H1 -3.175,-12.065; H2 -3.175,-10.795; H3 -3.175,-9.525; H4 -3.175,-8.255; H5 -3.175,-6.985; H6 -3.175,-5.715; H7 -3.175,-4.445; H8 -3.175,-3.175; H9 -3.175,-1.905; H10 -3.175,-0.635; H11 -3.175,0.635; H12 -3.175,1.905; H13 -3.175,3.175; H14 -3.175,4.445; H15 -3.175,5.715; H16 -3.175,6.985; H17 -3.175,8.255; H18 -3.175,9.525; H19 -3.175,10.795; H20 -3.175,12.065; J1 -1.905,-12.065; J2 -1.905,-10.795; J3 -1.905,-9.525; J4 -1.905,-8.255; J5 -1.905,-6.985; J6 -1.905,-5.715; J7 -1.905,-4.445; J8 -1.905,-3.175; J9 -1.905,-1.905; J10 -1.905,-0.635; J11 -1.905,0.635; J12 -1.905,1.905; J13 -1.905,3.175; J14 -1.905,4.445; J15 -1.905,5.715; J16 -1.905,6.985; J17 -1.905,8.255; J18 -1.905,9.525; J19 -1.905,10.795; J20 -1.905,12.065; K1 -0.635,-12.065; K2 -0.635,-10.795; K3 -0.635,-9.525; K4 -0.635,-8.255; K5 -0.635,-6.985; K6 -0.635,-5.715; K7 -0.635,-4.445; K8 -0.635,-3.175; K9 -0.635,-1.905; K10 -0.635,-0.635; K11 -0.635,0.635; K12 -0.635,1.905; K13 -0.635,3.175; K14 -0.635,4.445; K15 -0.635,5.715; K16 -0.635,6.985; K17 -0.635,8.255; K18 -0.635,9.525; K19 -0.635,10.795; K20 -0.635,12.065; L1 0.635,-12.065; L2 0.635,-10.795; L3 0.635,-9.525; L4 0.635,-8.255; L5 0.635,-6.985; L6 0.635,-5.715; L7 0.635,-4.445; L8 0.635,-3.175; L9 0.635,-1.905; L10 0.635,-0.635; L11 0.635,0.635; L12 0.635,1.905; L13 0.635,3.175; L14 0.635,4.445; L15 0.635,5.715; L16 0.635,6.985; L17 0.635,8.255; L18 0.635,9.525; L19 0.635,10.795; L20 0.635,12.065; M1 1.905,-12.065; M2 1.905,-10.795; M3 1.905,-9.525; M4 1.905,-8.255; M5 1.905,-6.985; M6 1.905,-5.715; M7 1.905,-4.445; M8 1.905,-3.175; M9 1.905,-1.905; M10 1.905,-0.635; M11 1.905,0.635; M12 1.905,1.905; M13 1.905,3.175; M14 1.905,4.445; M15 1.905,5.715; M16 1.905,6.985; M17 1.905,8.255; M18 1.905,9.525; M19 1.905,10.795; M20 1.905,12.065; N1 3.175,-12.065; N2 3.175,-10.795; N3 3.175,-9.525; N4 3.175,-8.255; N5 3.175,-6.985; N6 3.175,-5.715; N7 3.175,-4.445; N8 3.175,-3.175; N9 3.175,-1.905; N10 3.175,-0.635; N11 3.175,0.635; N12 3.175,1.905; N13 3.175,3.175; N14 3.175,4.445; N15 3.175,5.715; N16 3.175,6.985; N17 3.175,8.255; N18 3.175,9.525; N19 3.175,10.795; N20 3.175,12.065; P1 4.445,-12.065; P2 4.445,-10.795; P3 4.445,-9.525; P4 4.445,-8.255; P5 4.445,-6.985; P6 4.445,-5.715; P7 4.445,-4.445; P8 4.445,-3.175; P9 4.445,-1.905; P10 4.445,-0.635; P11 4.445,0.635; P12 4.445,1.905; P13 4.445,3.175; P14 4.445,4.445; P15 4.445,5.715; P16 4.445,6.985; P17 4.445,8.255; P18 4.445,9.525; P19 4.445,10.795; P20 4.445,12.065; R1 5.715,-12.065; R2 5.715,-10.795; R3 5.715,-9.525; R4 5.715,-8.255; R5 5.715,-6.985; R6 5.715,-5.715; R7 5.715,-4.445; R8 5.715,-3.175; R9 5.715,-1.905; R10 5.715,-0.635; R11 5.715,0.635; R12 5.715,1.905; R13 5.715,3.175; R14 5.715,4.445; R15 5.715,5.715; R16 5.715,6.985; R17 5.715,8.255; R18 5.715,9.525; R19 5.715,10.795; R20 5.715,12.065; T1 6.985,-12.065; T2 6.985,-10.795; T3 6.985,-9.525; T4 6.985,-8.255; T5 6.985,-6.985; T6 6.985,-5.715; T7 6.985,-4.445; T8 6.985,-3.175; T9 6.985,-1.905; T10 6.985,-0.635; T11 6.985,0.635; T12 6.985,1.905; T13 6.985,3.175; T14 6.985,4.445; T15 6.985,5.715; T16 6.985,6.985; T17 6.985,8.255; T18 6.985,9.525; T19 6.985,10.795; T20 6.985,12.065; U1 8.255,-12.065; U2 8.255,-10.795; U3 8.255,-9.525; U4 8.255,-8.255; U5 8.255,-6.985; U6 8.255,-5.715; U7 8.255,-4.445; U8 8.255,-3.175; U9 8.255,-1.905; U10 8.255,-0.635; U11 8.255,0.635; U12 8.255,1.905; U13 8.255,3.175; U14 8.255,4.445; U15 8.255,5.715; U16 8.255,6.985; U17 8.255,8.255; U18 8.255,9.525; U19 8.255,10.795; U20 8.255,12.065; V1 9.525,-12.065; V2 9.525,-10.795; V3 9.525,-9.525; V4 9.525,-8.255; V5 9.525,-6.985; V6 9.525,-5.715; V7 9.525,-4.445; V8 9.525,-3.175; V9 9.525,-1.905; V10 9.525,-0.635; V11 9.525,0.635; V12 9.525,1.905; V13 9.525,3.175; V14 9.525,4.445; V15 9.525,5.715; V16 9.525,6.985; V17 9.525,8.255; V18 9.525,9.525; V19 9.525,10.795; V20 9.525,12.065; W1 10.795,-12.065; W2 10.795,-10.795; W3 10.795,-9.525; W4 10.795,-8.255; W5 10.795,-6.985; W6 10.795,-5.715; W7 10.795,-4.445; W8 10.795,-3.175; W9 10.795,-1.905; W10 10.795,-0.635; W11 10.795,0.635; W12 10.795,1.905; W13 10.795,3.175; W14 10.795,4.445; W15 10.795,5.715; W16 10.795,6.985; W17 10.795,8.255; W18 10.795,9.525; W19 10.795,10.795; W20 10.795,12.065; Y1 12.065,-12.065; Y2 12.065,-10.795; Y3 12.065,-9.525; Y4 12.065,-8.255; Y5 12.065,-6.985; Y6 12.065,-5.715; Y7 12.065,-4.445; Y8 12.065,-3.175; Y9 12.065,-1.905; Y10 12.065,-0.635; Y11 12.065,0.635; Y12 12.065,1.905; Y13 12.065,3.175; Y14 12.065,4.445; Y15 12.065,5.715; Y16 12.065,6.985; Y17 12.065,8.255; Y18 12.065,9.525; Y19 12.065,10.795; Y20 12.065,12.065
DCK5 = smd 1.168 x 0.356: 1 -1.041,0.65; 2 -1.041,0; 3 -1.041,-0.65; 4 1.041,-0.65; 5 1.041,0.65
DBV5 = smd 1.473 x 0.559: 1 -1.194,0.95; 2 -1.194,0; 3 -1.194,-0.95; 4 1.194,-0.95; 5 1.194,0.95
SCHA5B0200 = smd 0.9 x 0.45: 1 -7.25,3.365; 2 -7.25,2.665; 3 -7.25,1.965; 4 -7.25,1.265; 5 7.25,1.265; 6 7.25,1.965; 7 7.25,2.665; 8 7.25,3.365 | smd 0.5 x 0.9: CD -5.975,13.35; GND 3.775,13.35 | smd 0.9 x 2: CGND1 -7.25,11; CGND4 7.25,9.7 | smd 1.1 x 1.5: CGND2 -7.188,0; CGND3 7.188,0 | smd 1.2 x 0.95: CGND5 2.575,13.9; CGND6 -3.425,13.9
USB_HOST_HORIZONTAL_W/CHASSIS_GND = drill 1: 1 -3.5,12.99; 2 -1,12.99; 3 1,12.99; 4 3.5,12.99 | drill 2.3: 5 -6.57,10.28; 6 6.57,10.28
10118192-0001LF(MICRO-USB-B-AMPHENOL-FCI) = smd 1.8 x 1.9: CGND1 -3.8,0; CGND4 3.8,0 | smd 1.9 x 1.9: CGND2 -1.2,0; CGND3 1.2,0 | smd 2.1 x 1.6: CGND5 3.1,2.55; CGND6 -3.1,2.55 | smd 0.4 x 1.35: D+ 0,2.675; D- -0.65,2.675; GND 1.3,2.675; ID 0.65,2.675; VBUS -1.3,2.675
CRYSTAL_5X3.2MM = smd 1.9 x 2.4: 1 -1.95,0; 2 1.95,0

### Placement (x,y rotation side)
5.0V  43.18,33.66 0 top
C1  20.45,9.78 180 top
C8  7.24,28.7 270 top
C9  15.75,1.65 270 top
C29  22.35,16.38 90 top
C30  22.35,18.67 270 top
C34  16,11.81 0 top
C35  51.18,8 0 top
C45  15.49,21.46 0 top
C46  15.75,22.86 0 top
C61  15.62,29.72 180 top
C62  18.92,24 0 top
C63  18.92,28.57 0 top
GND  40.64,33.66 0 top
L4  15.11,14.48 90 top
L5  13.97,26.42 180 top
POWER  6.11,8.48 0 top
PWR  8.38,31.24 180 top
R1  13.46,28.7 90 top
R2  12.19,28.7 90 top
R3  10.92,28.7 90 top
R4  9.65,28.7 90 top
R5  22.23,8.51 270 top
R6  22.23,6.1 90 top
R7  17.53,5.46 180 top
R8  42.42,1.27 180 top
R9  8.38,28.7 270 top
R10  14.61,1.65 270 top
R11  51.18,27.43 0 top
R12  51.18,26.29 0 top
R13  51.18,17.14 180 top
R14  51.18,16 180 top
R15  51.18,14.86 180 top
R16  51.18,13.72 0 top
R17  51.18,20.57 0 top
R18  51.18,21.72 0 top
R19  51.18,22.86 180 top
R20  51.18,19.43 180 top
R21  51.18,24 180 top
R22  51.18,25.15 180 top
R23  49.02,30.23 270 top
R24  46.74,30.23 270 top
R25  45.59,30.23 90 top
R26  51.18,18.29 180 top
R27  50.16,30.23 270 top
R28  47.88,30.23 270 top
R29  44.73,1.28 0 top
R32  21.21,17.53 90 top
R54  51.18,9.14 0 top
R55  51.18,10.29 0 top
R56  51.18,28.57 0 top
R57  51.18,11.43 0 top
R65  51.18,12.57 0 top
R95  18.92,29.72 180 top
R112  36.07,30.86 90 top
R119  16,28.19 0 top
R121  16,24.64 0 top
R150  21.46,21.34 180 top
R1100  21.46,22.48 180 top
R1200  34.29,30.48 90 top
RESET  9.41,3.48 0 top
SYS_5V  44.7,30.35 0 bottom
U1  19.56,7.49 180 top
U2  36.46,15.48 90 top
U3  20.41,1.57 0 top
U8  19.81,26.16 0 top
USR0  13.46,31.24 180 top
USR1  12.19,31.24 180 top
USR2  10.92,31.24 180 top
USR3  9.65,31.24 180 top
WP  13.21,6.6 0 top
WPG  13.21,9.53 0 top
X2  53.47,17.65 270 bottom
X3  0.13,18.67 270 top
X4  28.45,33.53 180 top
Y1  18.92,17.53 90 top

### Tracks (layer width: path | path; a pad name or v marks a point on that pad's centre or on a via)
3.3V  (22 unrouted)
5.0V  (7 unrouted)
BATT_LED_2  (1 unrouted)
CGND  (13 unrouted)
EQEP_1A  (1 unrouted)
EQEP_1B  (1 unrouted)
GND  (50 unrouted)
  pour Bottom: 10,0 5,0 0,5 0,30 5,35 50,35 55,30 55,5 50,0
I2C0_SCL  (3 unrouted)
I2C0_SDA  (3 unrouted)
LCD_DATA_14  (1 unrouted)
LDO_PGOOD  (1 unrouted)
MDIR_2B  (1 unrouted)
MDIR_3A  (1 unrouted)
MDIR_3B  (1 unrouted)
MDIR_4A  (1 unrouted)
MDIR_4B  (1 unrouted)
N$1  (1 unrouted)
N$3  (2 unrouted)
N$4  (2 unrouted)
N$6  (2 unrouted)
N$7  (2 unrouted)
N$8  (2 unrouted)
N$9  (2 unrouted)
N$11  (1 unrouted)
N$12  (1 unrouted)
N$26  (3 unrouted)
N$27  (3 unrouted)
N$28  (2 unrouted)
N$31  (2 unrouted)
N$42  (1 unrouted)
N$43  (1 unrouted)
N$44  (1 unrouted)
N$45  (1 unrouted)
N$46  (1 unrouted)
N$47  (1 unrouted)
N$57  (1 unrouted)
N$58  (1 unrouted)
N$59  (1 unrouted)
N$126  (1 unrouted)
N$128  (1 unrouted)
N$130  (1 unrouted)
N$131  (1 unrouted)
NTE1  (2 unrouted)
PMIC_INT  (1 unrouted)
PMIC_NWAKEUP  (1 unrouted)
PMIC_PGOOD  (2 unrouted)
PWR  (1 unrouted)
PWR_LEDR  (1 unrouted)
RESET  (4 unrouted)
SERVO_EN  (1 unrouted)
SVO5  (1 unrouted)
SVO6  (1 unrouted)
SVO7  (1 unrouted)
SVO8  (1 unrouted)
SYS_5V  (5 unrouted)
UART5_RX  (1 unrouted)
UART5_TX  (1 unrouted)
USB0_D_N  (1 unrouted)
USB0_D_P  (1 unrouted)
USB0_ID  (1 unrouted)
USB0_VBUS  (2 unrouted)
USB1_D_N  (1 unrouted)
USB1_D_P  (1 unrouted)
USB1_VBUS  (7 unrouted)
USB_DC  (2 unrouted)
VDD_1V8  (3 unrouted)
VDD_3V3AUX  (1 unrouted)
VDD_RTC  (1 unrouted)